# Altium schematic sheet Cyusb3314_Power.SchDoc
size 386 x 284 mm
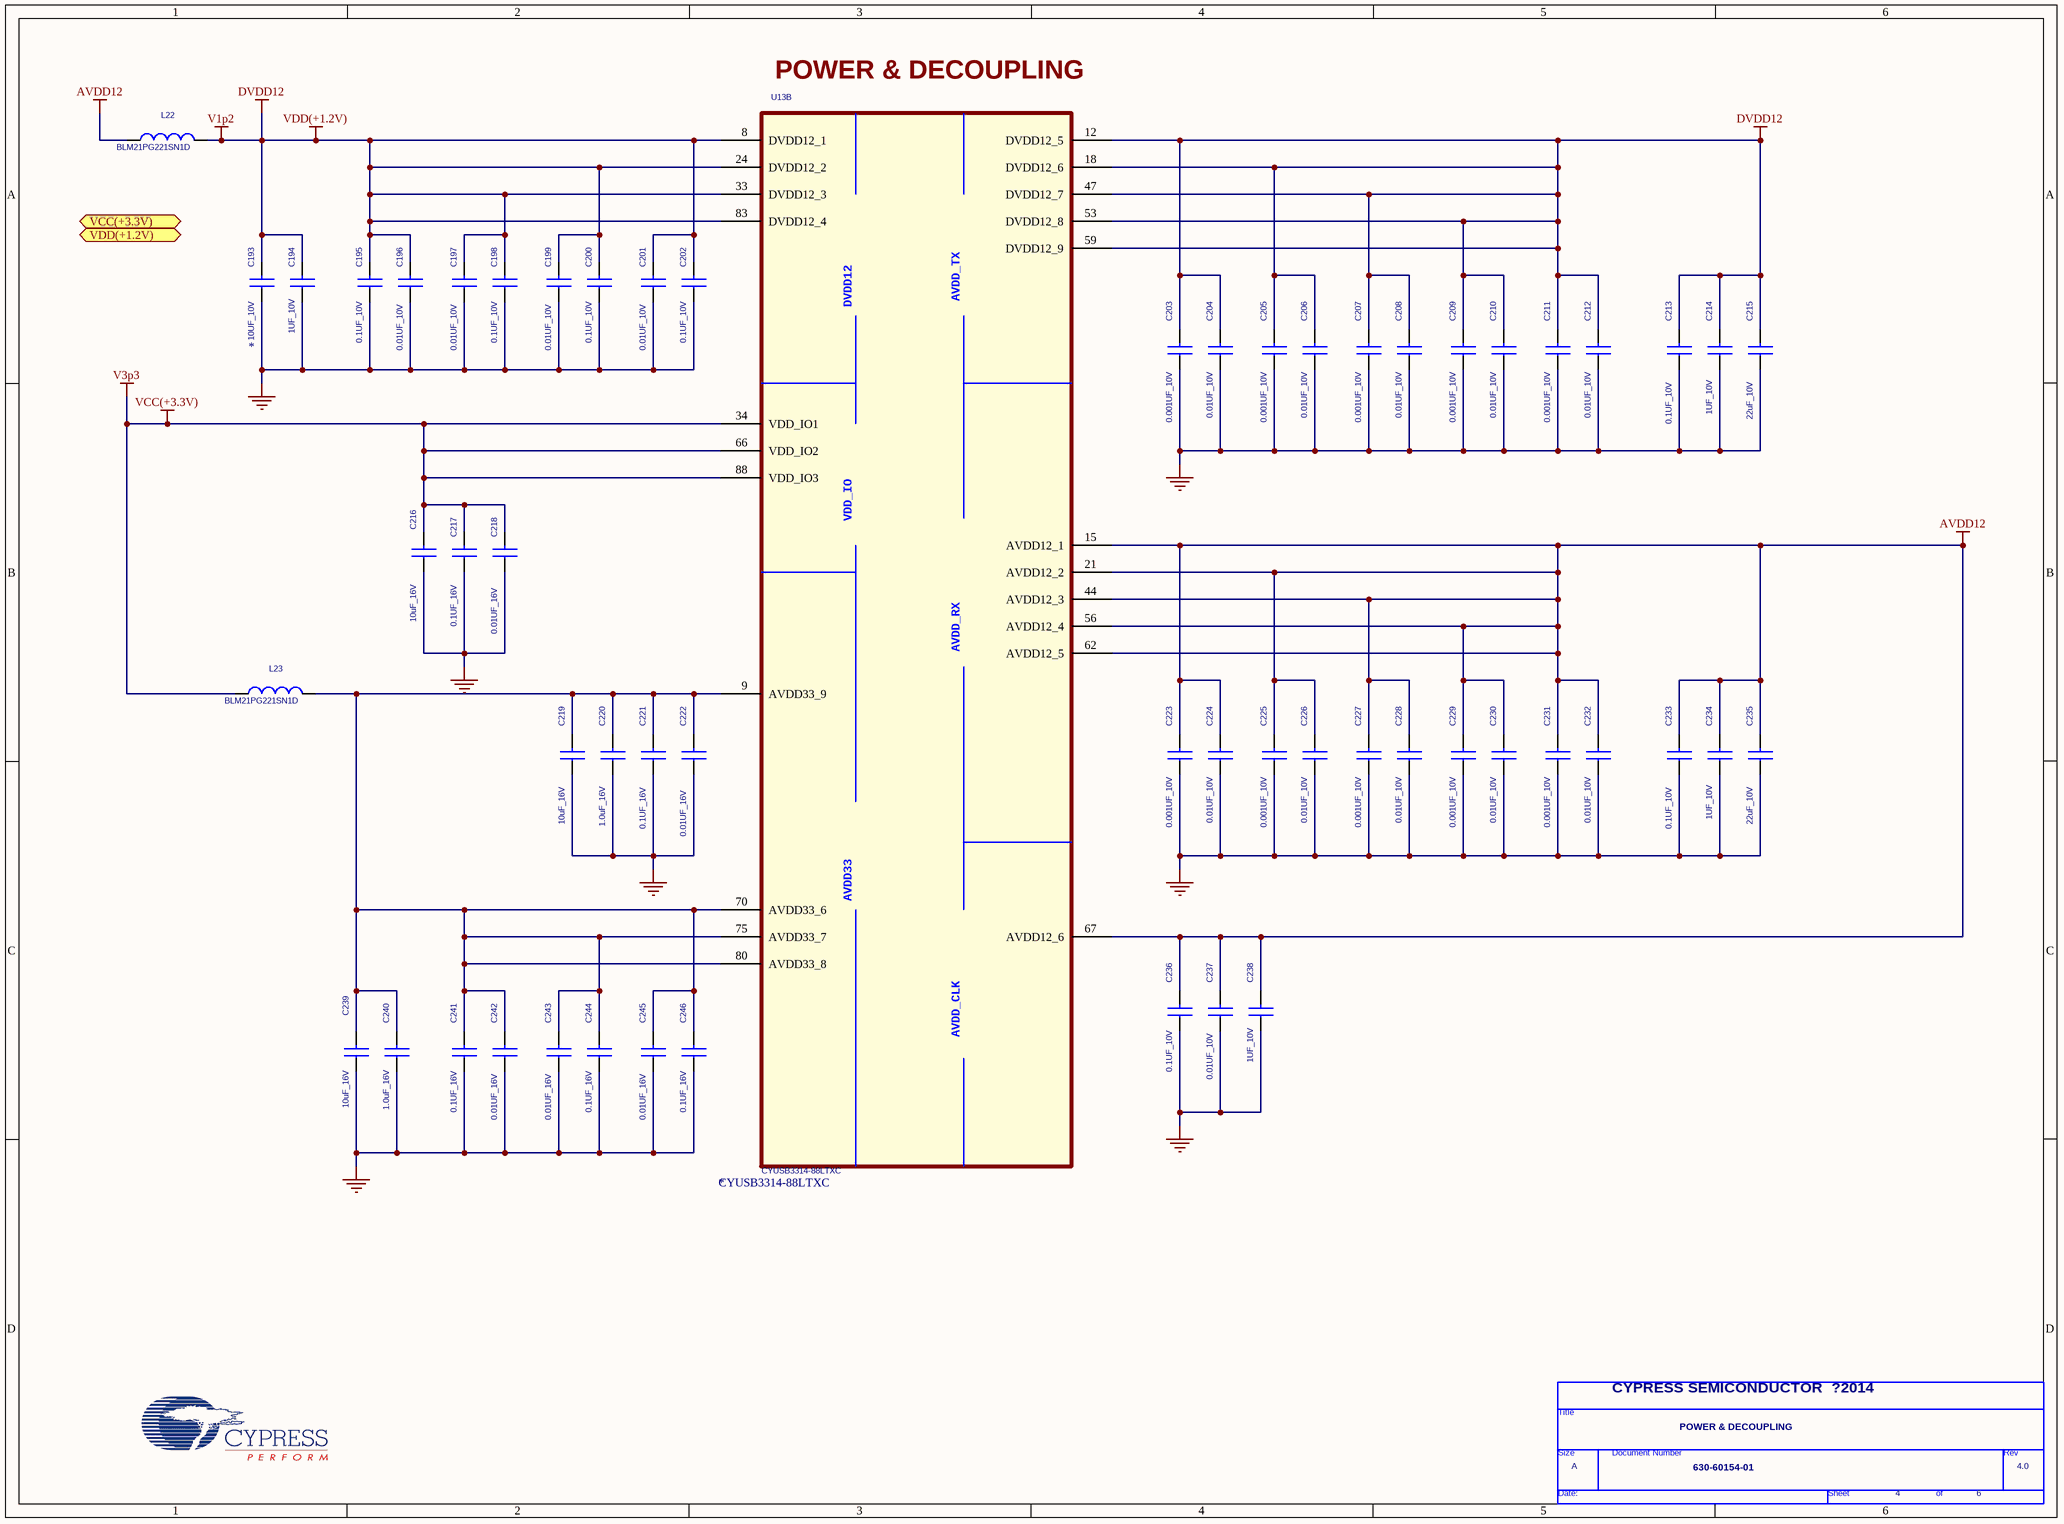
[diagram p0: Cyusb3314_Power.SchDoc]

## Parts
*  Page Count: 6  Page Number: 4  Page Size: A  Title: POWER & DECOUPLING  RevCode: 4.0  Doc: 630-60154-01  (hidden comment: TitleBlock0)  (graphical)
C193  10UF_10V  [C0603]
C194  1UF_10V  [C0603]
C195  0.1UF_10V  [C0402]
C196  0.01UF_10V  [C0402]
C197  0.01UF_10V  [C0402]
C198  0.1UF_10V  [C0402]
C199  0.01UF_10V  [C0402]
C200  0.1UF_10V  [C0402]
C201  0.01UF_10V  [C0402]
C202  0.1UF_10V  [C0402]
C203  0.001UF_10V  [C0402]
C204  0.01UF_10V  [C0402]
C205  0.001UF_10V  [C0402]
C206  0.01UF_10V  [C0402]
C207  0.001UF_10V  [C0402]
C208  0.01UF_10V  [C0402]
C209  0.001UF_10V  [C0402]
C210  0.01UF_10V  [C0402]
C211  0.001UF_10V  [C0402]
C212  0.01UF_10V  [C0402]
C213  0.1UF_10V  [C0402]
C214  1UF_10V  [C0603]
C215  22uF_10V  [C0603]
C216  10uF_16V  [C0603]
C217  0.1UF_16V  [C0402]
C218  0.01UF_16V  [C0402]
C219  10uF_16V  [C0603]
C220  1.0uF_16V  [C0603]
C221  0.1UF_16V  [C0402]
C222  0.01UF_16V  [C0402]
C223  0.001UF_10V  [C0402]
C224  0.01UF_10V  [C0402]
C225  0.001UF_10V  [C0402]
C226  0.01UF_10V  [C0402]
C227  0.001UF_10V  [C0402]
C228  0.01UF_10V  [C0402]
C229  0.001UF_10V  [C0402]
C230  0.01UF_10V  [C0402]
C231  0.001UF_10V  [C0402]
C232  0.01UF_10V  [C0402]
C233  0.1UF_10V  [C0402]
C234  1UF_10V  [C0603]
C235  22uF_10V  [C0603]
C236  0.1UF_10V  [C0402]
C237  0.01UF_10V  [C0402]
C238  1UF_10V  [C0603]
C239  10uF_16V  [C0603]
C240  1.0uF_16V  [C0603]
C241  0.1UF_16V  [C0402]
C242  0.01UF_16V  [C0402]
C243  0.01UF_16V  [C0402]
C244  0.1UF_16V  [C0402]
C245  0.01UF_16V  [C0402]
C246  0.1UF_16V  [C0402]
L22  BLM21PG221SN1D  [L0603]
L23  BLM21PG221SN1D  [L0603]
U13  CYUSB3314-88LTXC  [QFN40P1000X1000X100-89M]  (part B of 3)

## Ports
VCC(+3.3V) (in), VDD(+1.2V) (in)

## Nets
AVDD12: C223.2 C224.2 C225.2 C226.2 C227.2 C228.2 C229.2 C230.2 C231.2 C232.2 C233.2 C234.2 C235.2 C236.2 C237.2 C238.2 L22.1 U13.15(AVDD12_1) U13.21(AVDD12_2) U13.44(AVDD12_3) U13.56(AVDD12_4) U13.62(AVDD12_5) U13.67(AVDD12_6)
DVDD12: C193.2 C194.2 C195.2 C196.2 C197.2 C198.2 C199.2 C200.2 C201.2 C202.2 C203.2 C204.2 C205.2 C206.2 C207.2 C208.2 C209.2 C210.2 C211.2 C212.2 C213.2 C214.2 C215.2 L22.2 U13.8(DVDD12_1) U13.12(DVDD12_5) U13.18(DVDD12_6) U13.24(DVDD12_2) U13.33(DVDD12_3) U13.47(DVDD12_7) U13.53(DVDD12_8) U13.59(DVDD12_9) U13.83(DVDD12_4)  [also labelled V1p2, VDD(+1.2V)]
GND: C193.1 C194.1 C195.1 C196.1 C197.1 C198.1 C199.1 C200.1 C201.1 C202.1 C203.1 C204.1 C205.1 C206.1 C207.1 C208.1 C209.1 C210.1 C211.1 C212.1 C213.1 C214.1 C215.1 C216.1 C217.1 C218.1 C219.1 C220.1 C221.1 C222.1 C223.1 C224.1 C225.1 C226.1 C227.1 C228.1 C229.1 C230.1 C231.1 C232.1 C233.1 C234.1 C235.1 C236.1 C237.1 C238.1 C239.1 C240.1 C241.1 C242.1 C243.1 C244.1 C245.1 C246.1
V3p3: C216.2 C217.2 C218.2 L23.1 U13.34(VDD_IO1) U13.66(VDD_IO2) U13.88(VDD_IO3)  [also labelled VCC(+3.3V)]
NetC219_2: C219.2 C220.2 C221.2 C222.2 C239.2 C240.2 C241.2 C242.2 C243.2 C244.2 C245.2 C246.2 L23.2 U13.9(AVDD33_9) U13.70(AVDD33_6) U13.75(AVDD33_7) U13.80(AVDD33_8)

## Notes on the sheet
- POWER & DECOUPLING
- CYPRESS SEMICONDUCTOR  ?2014
- (in symbol CYUSB3314-88LTXC_2, part B) AVDD_TX; DVDD12; VDD_IO; AVDD_RX; AVDD33; AVDD_CLK
- (in symbol TitleBlock0) Title; Size; Document Number; Rev; Date:; Sheet; of

## Library data of the parts
C193-C246 = CAPACITOR NON-POL: Manufacturer: *; Part Number: *
  C196: Decription: *
L22 L23 = INDUCTOR: FERRITE CHIP 220 OHM 2A 0805; Manufacturer: Murata; DEVICE: L4; Part Number: BLM21PG221SN1D; Lead Free: YES
U13 = CYUSB3314-88LTXC_2: Manufacturer: *; Part Number: CYUSB3314-88LTXC
* = TitleBlock0: Page Create Date: March  8, 1995